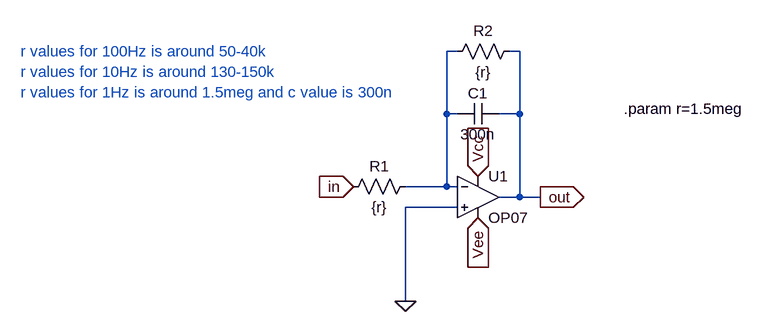
[diagram p0: schematic integrator_2.asc]
integrator_2.asc, the LTspice schematic file:
Version 4.1
SHEET 1 880 680
WIRE 176 -16 160 -16
WIRE 272 -16 256 -16
WIRE 160 80 160 -16
WIRE 176 80 160 80
WIRE 272 80 272 -16
WIRE 272 80 240 80
WIRE 160 192 160 80
WIRE 160 192 96 192
WIRE 176 192 160 192
WIRE 272 208 272 80
WIRE 272 208 240 208
WIRE 304 208 272 208
WIRE 176 224 96 224
WIRE 96 368 96 224
FLAG 208 240 Vee
IOPIN 208 240 In
FLAG 208 176 Vcc
IOPIN 208 176 In
FLAG 96 368 0
FLAG 16 192 in
IOPIN 16 192 In
FLAG 304 208 out
IOPIN 304 208 Out
SYMBOL OpAmps\\OP07 208 144 R0
SYMATTR InstName U1
SYMBOL cap 240 64 R90
WINDOW 0 0 32 VBottom 2
WINDOW 3 32 32 VTop 2
SYMATTR InstName C1
SYMATTR Value 300n
SYMBOL res 112 176 R90
WINDOW 0 0 56 VBottom 2
WINDOW 3 32 56 VTop 2
SYMATTR InstName R1
SYMATTR Value {r}
SYMBOL res 272 -32 R90
WINDOW 0 0 56 VBottom 2
WINDOW 3 32 56 VTop 2
SYMATTR InstName R2
SYMATTR Value {r}
TEXT 432 72 Left 2 !.param r=1.5meg
TEXT -496 -16 Left 2 ;r values for 100Hz is around 50-40k \nr values for 10Hz is around 130-150k\nr values for 1Hz is around 1.5meg and c value is 300n

The netlist it stands for:
* integrator_2.asc
X§U1 0 N001 Vcc Vee out LT1001  ; OP07, pins In+ In- V+ V- OUT
C1 out N001 300n
R1 N001 in {r}
R2 out N001 {r}
.param r=1.5meg
* r values for 100Hz is around 50-40k
* r values for 10Hz is around 130-150k
* r values for 1Hz is around 1.5meg and c value is 300n
.lib LTC.lib
.backanno
.end